# Altium schematic sheet MCU+DDS.SchDoc
size A; SheetNumber: 2; SheetTotal: 4
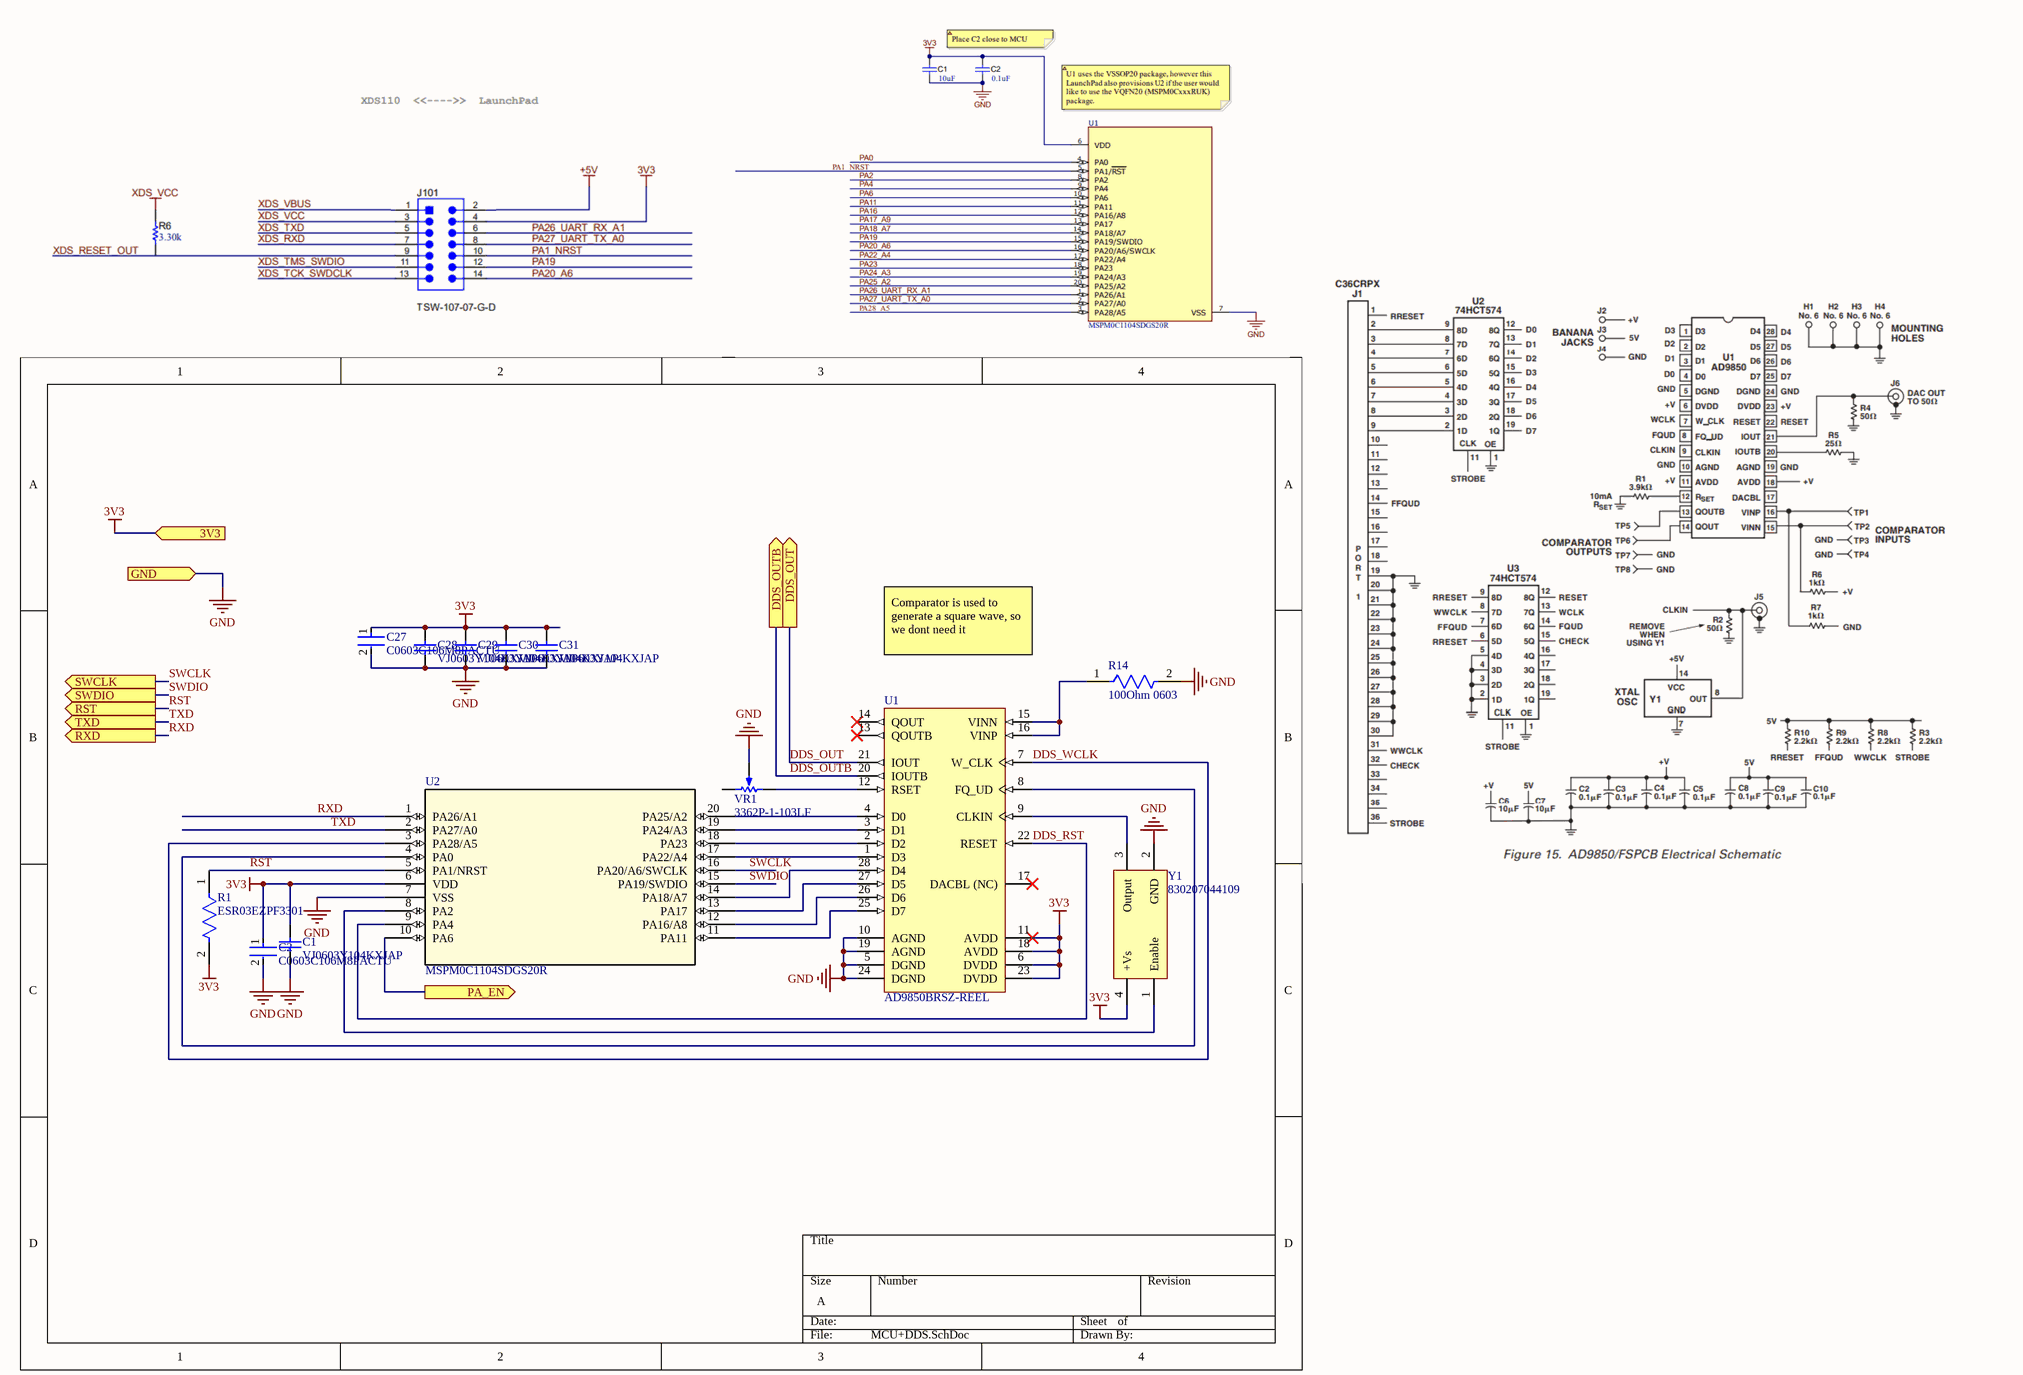
[diagram p0: MCU+DDS.SchDoc]

## Parts
C1  VJ0603Y104KXJAP  [CAPC1608X92X38NL15T08]
C2  C0603C106M8PACTU  [FP-C0603C106M8PACTU-MFG]
C27  C0603C106M8PACTU  [FP-C0603C106M8PACTU-MFG]
C28  VJ0603Y104KXJAP  [CAPC1608X92X38NL15T08]
C29  VJ0603Y104KXJAP  [CAPC1608X92X38NL15T08]
C30  VJ0603Y104KXJAP  [CAPC1608X92X38NL15T08]
C31  VJ0603Y104KXJAP  [CAPC1608X92X38NL15T08]
R1  ESR03EZPF3301  [FP-ESR03-IPC_A]
R14  100Ohm 0603  [FP-CRCW0603-e3-IPC_B]
U1  AD9850BRSZ-REEL  [ADI-RS-28_N]
U2  MSPM0C1104SDGS20R  [DGS0020A_TEX]
VR1  3362P-1-103LF  [BOUR-3362P]
Y1  830207044109  [WE-SPXO_CFPS-39]

## Ports
3V3 (in), DDS_OUT (out), DDS_OUTB (out), GND (in), PA_EN (out), RST (out), RXD (out), SWCLK (out), SWDIO (out), TXD (out)

## Nets
3V3: C1.2 C2.1 C27.1 C28.2 C29.2 C30.2 C31.2 R1.2 U1.6(DVDD) U1.11(AVDD) U1.18(AVDD) U1.23(DVDD) U2.6(VDD) Y1.4(+Vs) ; port 3V3
GND: C1.1 C2.2 C27.2 C28.1 C29.1 C30.1 C31.1 R14.2 U1.5(DGND) U1.10(AGND) U1.19(AGND) U1.24(DGND) U2.7(VSS) VR1.2(S) Y1.2(GND) ; port GND
DDS_OUT: U1.21(IOUT) ; port DDS_OUT
DDS_OUTB: U1.20(IOUTB) ; port DDS_OUTB
DDS_RST: U1.22(RESET) U2.9(PA4)
DDS_WCLK: U1.7(W_CLK) U2.3(PA28/A5)
PA_EN: U2.10(PA6) ; port PA_EN
RST: R1.1 U2.5(PA1/NRST) ; port RST
RXD: U2.1(PA26/A1) ; port RXD
SWCLK: U2.16(PA20/A6/SWCLK) ; port SWCLK
SWDIO: U2.15(PA19/SWDIO) ; port SWDIO
TXD: U2.2(PA27/A0) ; port TXD
NetR14_1: R14.1 U1.15(VINN) U1.16(VINP)
NetU1_1: U1.1(D3) U2.17(PA22/A4)
NetU1_2: U1.2(D2) U2.18(PA23)
NetU1_3: U1.3(D1) U2.19(PA24/A3)
NetU1_4: U1.4(D0) U2.20(PA25/A2)
NetU1_8: U1.8(FQ_UD) U2.4(PA0)
NetU1_9: U1.9(CLKIN) Y1.3(Output)
NetU1_12: U1.12(RSET) VR1.1(CCW)
NetU1_25: U1.25(D7) U2.11(PA11)
NetU1_26: U1.26(D6) U2.12(PA16/A8)
NetU1_27: U1.27(D5) U2.13(PA17)
NetU1_28: U1.28(D4) U2.14(PA18/A7)
NetU2_8: U2.8(PA2) Y1.1(Enable)

Not connected (* = marked no-connect by the designer): U1 13(QOUTB)* 14(QOUT)* 17(DACBL_(NC))*; VR1 3(CW)

## Notes on the sheet
- Comparator is used to generate a square wave, so we dont need it

## Library data of the parts
C1 C28-C31 = CMP-2006-01211-1: Manufacturer: Vitramon; Part Number: VJ0603Y104KXJAP
C2 C27 = CMP-03020-034654-1: CAP CER 10UF 10V X5R 0603; RoHS Compliant: Yes
R1 = CMP-08839-028747-1: 3.3kΩ ±1% 0.25W 0603 Anti-Surge Chip Resistor AEC-Q200; Temperature Coefficient: 100ppm/°C; Resistance: 3.3kR; Max Power Dissipation: 250mW; Tolerance: 1%; Min Operating Temperature: -55°C; Features: Automotive AEC-Q200; Max Operating Temperature: 155°C; Number of Terminations: 2; Series: ESR; Packaging: Tape and Reel; Resistor Type: Thick Film; RoHS Compliant: Yes; Case/Package: 0603
R14 = CMP-2000-03097-2: Voltage Rating: 75V; Temperature Coefficient: 100ppm/°C; Power Rating: 100mW; Resistance: 22R; Tolerance: 1%; Lead Free: Lead Free; Height: 0.45mm; Package Quantity: 5000; Weight: 7.1E-05oz; Width: 0.85mm; Length: 1.55mm; Mount: Surface Mount; Packaging: Tape and Reel; Termination: SMD/SMT; Case/Package: 0603; Case Code (Metric): 1608; Radiation Hardening: No; Max Operating Temperature: 155°C; Military Standard: Not; Min Operating Temperature: -55°C; Case Code (Imperial): 0603; Contact Plating: Tin; Voltage Rating (DC): 75V; Depth: 0.85mm; Composition: Thick Film
U1 = CMP-0293-00041-1: CMOS, 125 MHz Complete DDS Synthesizer, 10-Bit, Parallel, Serial, RS-28, 1500 Reel, Pb-Free; Tuning Word Width (bits): 32bit; Master fclk: 125MHz; Resolution (Bits): 10bit; REFCLK Multiplier: No; Compliance Range (V): 1.5V; FS Iout (mA nom): 20mA; I Supply total (max): 96mA; ComponentLink3Description: Package Specification; Code_JEDEC: MO-150-AH; ComponentLink1URL: www.analog.com; I/O Interface: Parallel, Serial; PackageDescription: 28-Lead Shrink Small Outline Package [SSOP]; ComponentLink2URL: http://www.analog.com/static/imported-files/data_sheets/AD9850.pdf; ComponentLink3URL: http://www.analog.com/static/imported-files/packages/32122249223724RS_28.pdf; ComponentLink2Description: Datasheet; PackageVersion: revA, 1997; ComponentLink1Description: Manufacturer URL; PackageReference: RS-28; DatasheetVersion: Rev. H
U2 = MSPM0C1104SDGS20R: 24MHz ArmÂ® CortexÂ®-M0+ MCU with 16KB flash, 1KB SRAM, 12-bit ADC 20-VSSOP -40 to 125; Manufacturer_Name: Texas Instruments; Copyright: Copyright (C) 2025 Ultra Librarian. All rights reserved.; Manufacturer_Part_Number: MSPM0C1104SDGS20R; Datasheet: https://www.ti.com/lit/gpn/mspm0c1104; RefDes: RefDes; Type: Type
VR1 = CMP-1747-00004-1: Square Trimpot(R) Trimming Potentiometer, 10 KOhm, 300 V, -55 to 125 degC, 3-Pin THD, RoHS, Tube; Voltage Rating: 220 mV; Power Rating: 1 W; Tolerance: 1%; Resistance: 50 mohm; Case/Package: 1206; Length: 3.2 mm; RoHSCompliant: True; PackageDescription: 3-Pin Through Hole Device, Body 6.6 x 6.99 mm, Pitch 2.54 mm; ComponentLink2Description: Datasheet; REACH SVHC: No SVHC; Mount: Surface Mount; Height: 0.6 mm; Packaging: Tape and Reel; ComponentLink1URL: http://www.bourns.com/; Case Code (Imperial): 0612; Pins: 2; Case Code (Metric): 1632; ComponentLink2URL: http://www.bourns.com/docs/Product-Datasheets/3362.pdf; Min Operating Temperature: -25degC; ComponentLink1Description: Manufacturer URL; PackageReference: 3326P; Max Operating Temperature: 125degC; Width: 1.6 mm; Package Quantity: 5000; DatasheetVersion: May-16
Y1 = CMP-03913-116855802-1: 830207044109 WE-SPXO Crystal Oscillator; Frequency: 100MHz; NexarPartId: 116855802; Length: 3.2mm; Width: 2.5mm; Max Operating Temperature: 85°C; Height: 1.2mm; Min Operating Temperature: -40°C